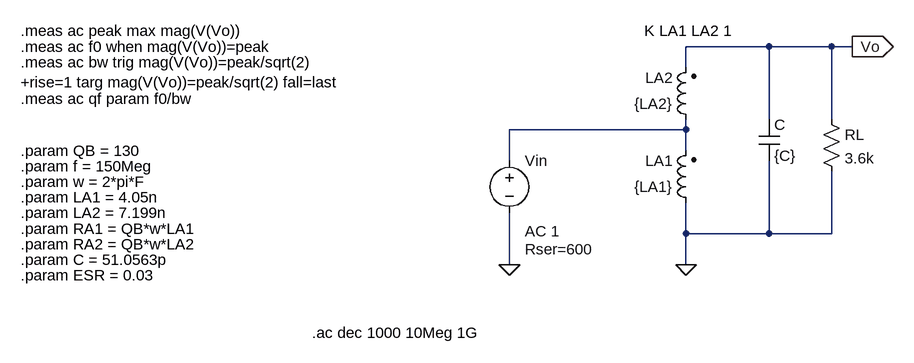
[diagram p0: schematic Design_RLC.asc]
Design_RLC.asc, the LTspice schematic file:
Version 4
SHEET 1 1640 680
WIRE 800 -48 672 -48
WIRE 896 -48 800 -48
WIRE 928 -48 896 -48
WIRE 672 -16 672 -48
WIRE 800 64 800 -48
WIRE 896 64 896 -48
WIRE 672 80 672 64
WIRE 672 80 400 80
WIRE 672 112 672 80
WIRE 400 128 400 80
WIRE 672 240 672 192
WIRE 800 240 800 128
WIRE 800 240 672 240
WIRE 896 240 896 144
WIRE 896 240 800 240
WIRE 400 288 400 208
WIRE 672 288 672 240
FLAG 400 288 0
FLAG 672 288 0
FLAG 928 -48 Vo
IOPIN 928 -48 Out
SYMBOL voltage 400 112 R0
WINDOW 123 24 124 Left 2
WINDOW 39 24 152 Left 2
SYMATTR Value2 AC 1
SYMATTR SpiceLine Rser=600
SYMATTR InstName Vin
SYMATTR Value ""
SYMBOL res 880 48 R0
SYMATTR InstName RL
SYMATTR Value 3.6k
SYMBOL cap 784 64 R0
SYMATTR InstName C
SYMATTR Value {C}
SYMATTR SpiceLine Rser={ESR}
SYMBOL ind2 688 208 R180
WINDOW 0 36 80 Left 2
WINDOW 3 36 40 Left 2
SYMATTR InstName LA1
SYMATTR Value {LA1}
SYMATTR Type ind
SYMATTR SpiceLine Rpar={RA1}
SYMBOL ind2 688 80 R180
WINDOW 0 36 80 Left 2
WINDOW 3 36 40 Left 2
SYMATTR InstName LA2
SYMATTR Value {LA2}
SYMATTR Type ind
SYMATTR SpiceLine Rpar={RA2}
TEXT -352 112 Left 2 !.param QB = 130
TEXT -352 136 Left 2 !.param f = 150Meg
TEXT -352 160 Left 2 !.param w = 2*pi*F
TEXT -352 184 Left 2 !.param LA1 = 4.05n
TEXT -352 208 Left 2 !.param LA2 = 7.199n
TEXT -352 232 Left 2 !.param RA1 = QB*w*LA1
TEXT -352 256 Left 2 !.param RA2 = QB*w*LA2
TEXT 96 392 Left 2 !.ac dec 1000 10Meg 1G
TEXT -352 280 Left 2 !.param C = 51.0563p
TEXT -352 -72 Left 2 !.meas ac peak max mag(V(Vo))
TEXT -352 -48 Left 2 !.meas ac f0 when mag(V(Vo))=peak
TEXT -352 -24 Left 2 !.meas ac bw trig mag(V(Vo))=peak/sqrt(2)\n+rise=1 targ mag(V(Vo))=peak/sqrt(2) fall=last
TEXT -352 32 Left 2 !.meas ac qf param f0/bw
TEXT -352 304 Left 2 !.param ESR = 0.03
TEXT 608 -72 Left 2 !K LA1 LA2 1

The netlist it stands for:
* Design_RLC.asc
Vin N001 0 AC 1 Rser=600
RL Vo 0 3.6k
C Vo 0 {C} Rser={ESR}
LA1 0 N001 {LA1} Rpar={RA1}
LA2 N001 Vo {LA2} Rpar={RA2}
.param QB = 130
.param f = 150Meg
.param w = 2*pi*F
.param LA1 = 4.05n
.param LA2 = 7.199n
.param RA1 = QB*w*LA1
.param RA2 = QB*w*LA2
.ac dec 1000 10Meg 1G
.param C = 51.0563p
.meas ac peak max mag(V(Vo))
.meas ac f0 when mag(V(Vo))=peak
.meas ac bw trig mag(V(Vo))=peak/sqrt(2)
+rise=1 targ mag(V(Vo))=peak/sqrt(2) fall=last
.meas ac qf param f0/bw
.param ESR = 0.03
K LA1 LA2 1
.backanno
.end